# EAGLE board dw08b (EAGLE 6.6.0), part 1 of 5
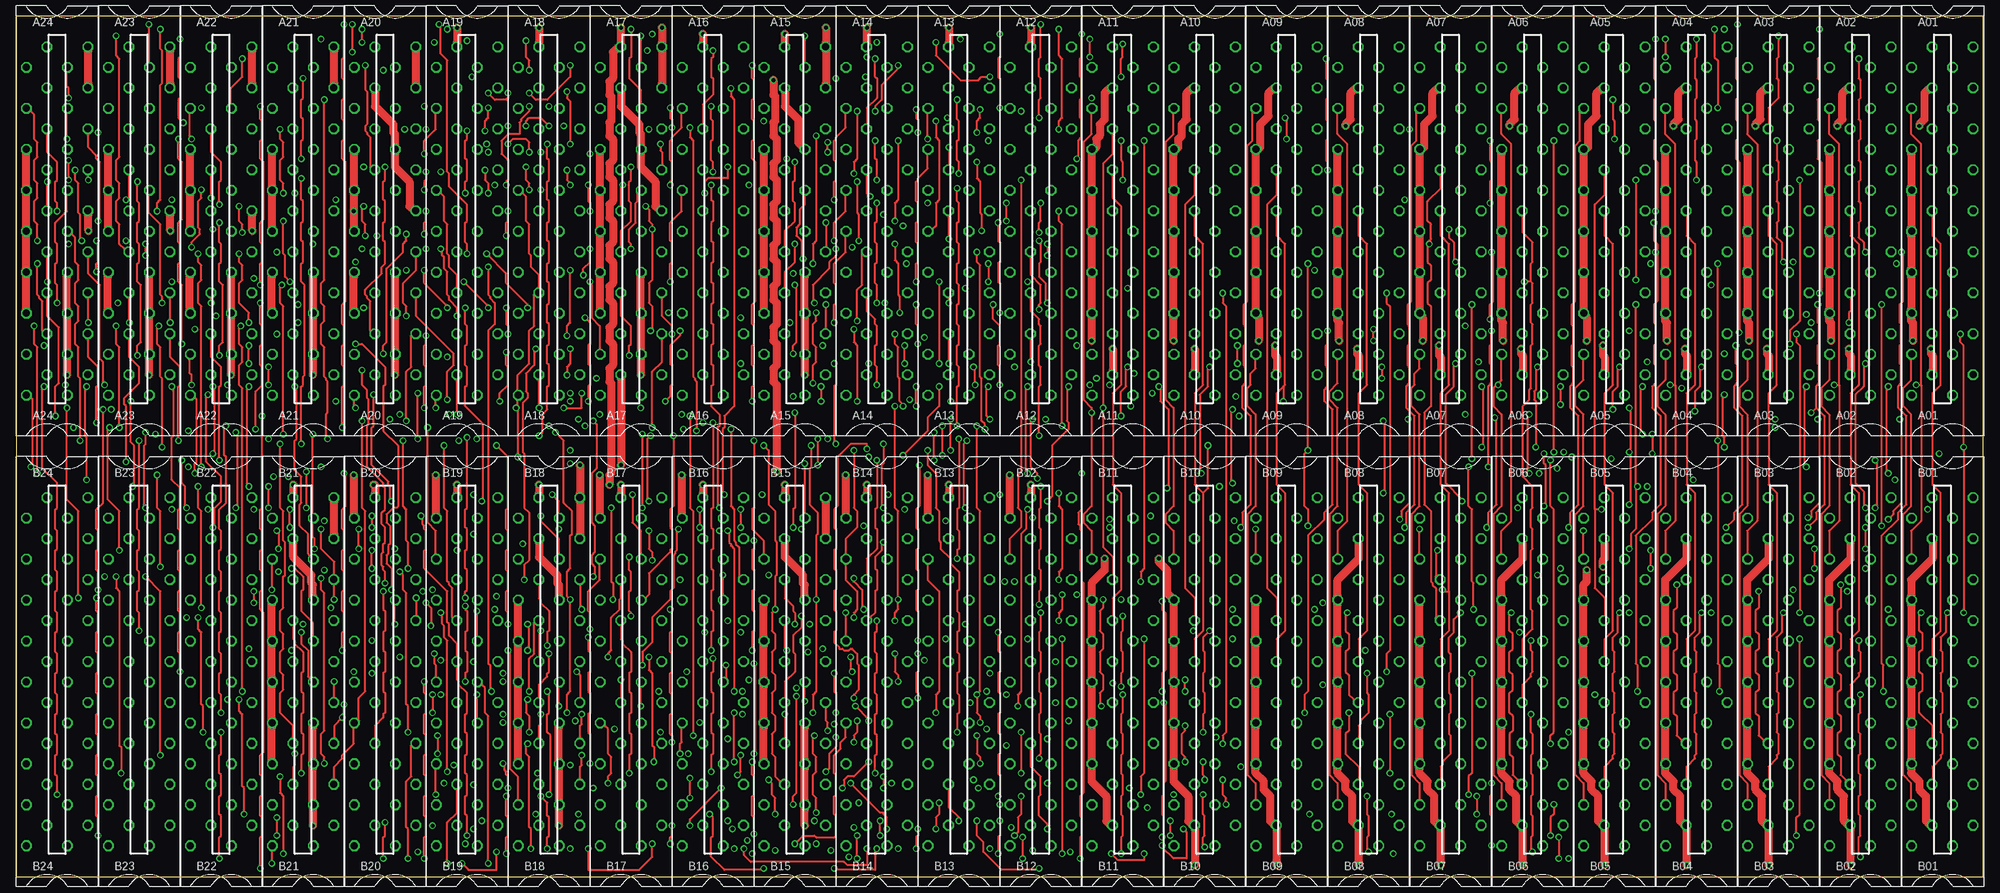
[diagram p7: board, top side]
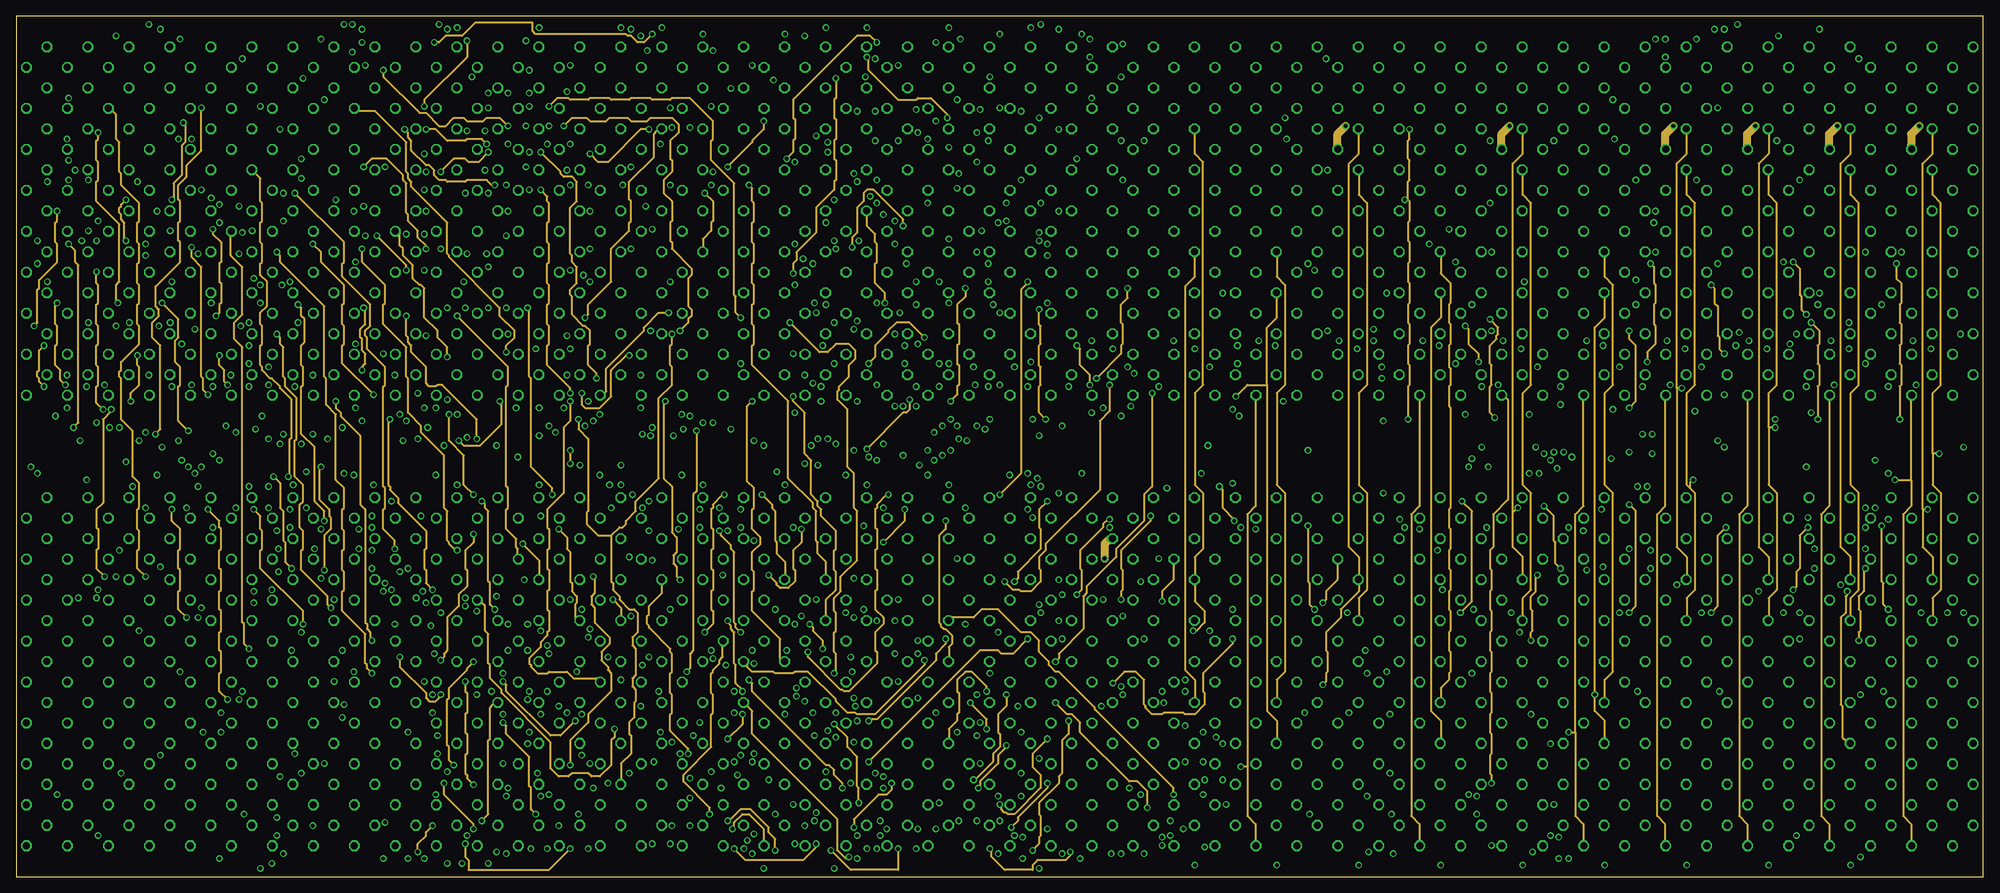
[diagram p8: board, inner layer 2]
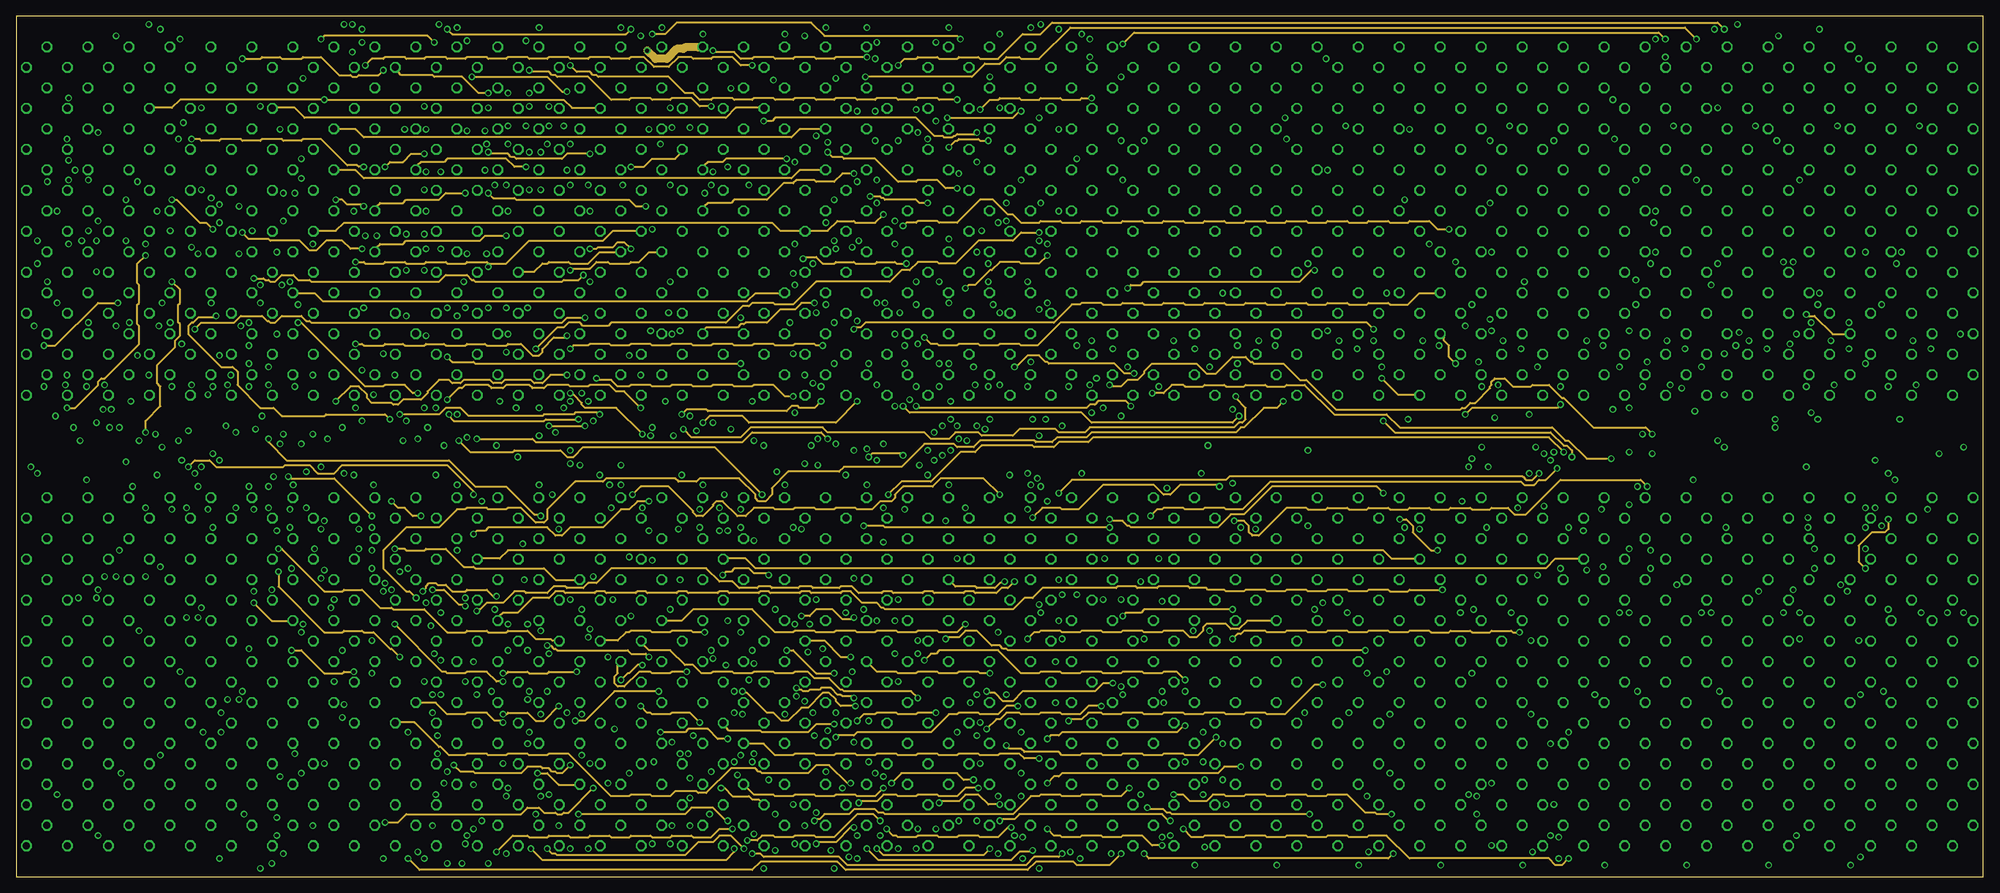
[diagram p9: board, inner layer 15]
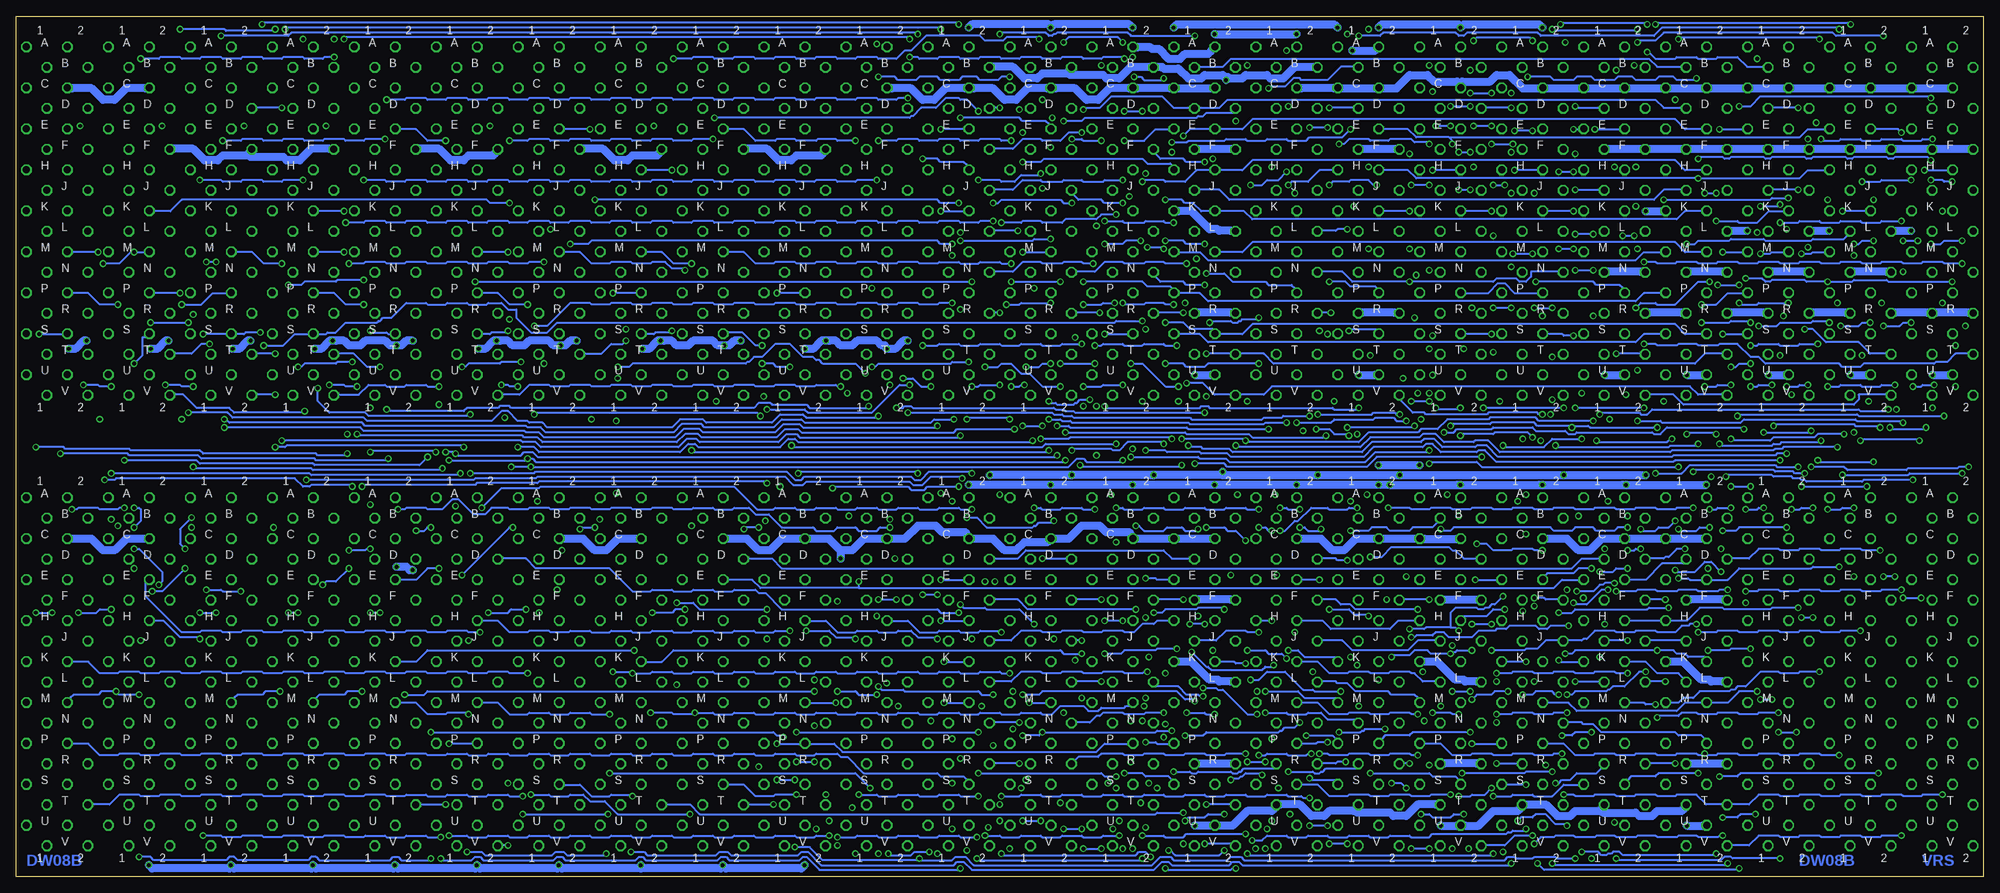
[diagram p10: board, bottom side, seen from below]

Size 304.8 x 133.35 mm. Coordinates in mm from the lower left corner, seen from the top.
Outline: 0,0 304.8,0 304.8,133.35 0,133.35 0,0
Copper layers (1*2*15*16): Top 0.035mm / dielectric 1.5mm / 2 0.035mm / dielectric 0.15mm / 15 0.035mm / dielectric 0.2mm / Bottom 0.035mm
Design rules "10mils": minimum track width 12mil, minimum drill 24mil, track to track 10mil, track to pad 10mil, pad to pad 10mil, via to via 10mil, smd to smd 10mil, copper to edge 25mil, drill to drill 10mil, minimum pad ring 10mil, minimum via ring 8mil, stop-mask expansion 0mil, vias tented up to drill 0mil, thermal gap 10mil
Net classes: 1 supply: width 1.27 mm

## Footprints (pad centres in the part's own frame; a part is rotated, then mirrored left to right if it is on the bottom)
H807 = drill 1.092 octagon: A1 4.763,28.575; A2 -1.587,28.575; B1 1.587,25.4; B2 -4.763,25.4; C1 4.763,22.225; C2 -1.587,22.225; D1 1.587,19.05; D2 -4.763,19.05; E1 4.763,15.875; E2 -1.587,15.875; F1 1.587,12.7; F2 -4.763,12.7; H1 4.763,9.525; H2 -1.587,9.525; J1 1.587,6.35; J2 -4.763,6.35; K1 4.763,3.175; K2 -1.587,3.175; L1 1.587,0; L2 -4.763,0; M1 4.763,-3.175; M2 -1.587,-3.175; N1 1.587,-6.35; N2 -4.763,-6.35; P1 4.763,-9.525; P2 -1.587,-9.525; R1 1.587,-12.7; R2 -4.763,-12.7; S1 4.763,-15.875; S2 -1.587,-15.875; T1 1.587,-19.05; T2 -4.763,-19.05; U1 4.763,-22.225; U2 -1.587,-22.225; V1 1.587,-25.4; V2 -4.763,-25.4

## Placement (x,y rotation side)
A01  W011  [H807]  298.45,100.01 0 top
A02  W011  [H807]  285.75,100.01 0 top
A03  W011  [H807]  273.05,100.01 0 top
A04  W011  [H807]  260.35,100.01 0 top
A05  W011  [H807]  247.65,100.01 0 top
A06  W011  [H807]  234.95,100.01 0 top
A07  W011  [H807]  222.25,100.01 0 top
A08  W011  [H807]  209.55,100.01 0 top
A09  W011  [H807]  196.85,100.01 0 top
A10  W011  [H807]  184.15,100.01 0 top
A11  W011  [H807]  171.45,100.01 0 top
A12  M508  [H807]  158.75,100.01 0 top
A13  M508  [H807]  146.05,100.01 0 top
A14  M508  [H807]  133.35,100.01 0 top
A15  M906  [H807]  120.65,100.01 0 top
A16  M508  [H807]  107.95,100.01 0 top
A17  M906  [H807]  95.25,100.01 0 top
A18  M660  [H807]  82.55,100.01 0 top
A19  M660  [H807]  69.85,100.01 0 top
A20  M903  [H807]  57.15,100.01 0 top
A21  M903  [H807]  44.45,100.01 0 top
A22  M903  [H807]  31.75,100.01 0 top
A23  M903  [H807]  19.05,100.01 0 top
A24  M903  [H807]  6.35,100.01 0 top
B01  W011  [H807]  298.45,30.16 0 top
B02  W011  [H807]  285.75,30.16 0 top
B03  W011  [H807]  273.05,30.16 0 top
B04  W011  [H807]  260.35,30.16 0 top
B05  W011  [H807]  247.65,30.16 0 top
B06  W011  [H807]  234.95,30.16 0 top
B07  W011  [H807]  222.25,30.16 0 top
B08  W011  [H807]  209.55,30.16 0 top
B09  W011  [H807]  196.85,30.16 0 top
B10  W011  [H807]  184.15,30.16 0 top
B11  W011  [H807]  171.45,30.16 0 top
B12  M508  [H807]  158.75,30.16 0 top
B13  M508  [H807]  146.05,30.16 0 top
B14  M508  [H807]  133.35,30.16 0 top
B15  M906  [H807]  120.65,30.16 0 top
B16  M051  [H807]  107.95,30.16 0 top
B17  M051  [H807]  95.25,30.16 0 top
B18  M906  [H807]  82.55,30.16 0 top
B19  M051  [H807]  69.85,30.16 0 top
B20  M051  [H807]  57.15,30.16 0 top
B21  M906  [H807]  44.45,30.16 0 top
B22  H807  [H807]  31.75,30.16 0 top
B23  H807  [H807]  19.05,30.16 0 top
B24  H807  [H807]  6.35,30.16 0 top

## Tracks (layer width: path | path; a pad name or v marks a point on that pad's centre or on a via)
!N_MB03  (via drill 0.61)
  Top 0.305: 271.53,70.87 271.53,60.71 272.8,59.44 272.8,38.1 271.53,36.83 271.53,34.04 B03.K2 | 271.53,70.87 271.53,74.93 272.8,76.2 272.8,98.04 271.53,99.31 271.53,102.62 A03.K2 | v158.5,87.88 158.5,88.65 158.75,88.9 158.75,91.69 157.23,93.22 157.23,96.27 A12.M2 | v272.54,70.87 271.53,70.87
  2 0.305: v158.5,87.88 158.5,85.6 158.75,85.34 158.75,82.55 158.5,82.3 158.5,79.25 158.75,78.99 158.75,76.2 158.5,75.95 158.5,71.88 v159.51,70.87
  Bottom 0.305: v159.51,70.87 162.56,70.87 163.07,70.36 182.63,70.36 183.13,70.87 186.18,70.87 187.45,69.6 198.12,69.6 198.63,70.1 201.68,70.1 202.95,68.83 222.76,68.83 223.52,69.6 225.55,69.6 225.81,69.85 250.7,69.85 251.21,70.36 271.78,70.36 272.29,70.87 v272.54,70.87
!N_MB04  (via drill 0.61)
  Top 0.305: v270,44.2 270,41.66 269.49,41.15 269.49,38.1 270,37.59 270,35.31 269.49,34.8 269.49,31.75 270,31.24 270,28.96 269.49,28.45 269.49,25.4 270,24.89 270,21.84 270.76,21.08 B03.P2 | v277.62,54.1 278.89,55.37 278.89,56.39 280.16,57.66 280.16,71.37 278.89,72.64 | 278.89,72.64 278.89,75.95 279.4,76.45 279.4,79.25 279.15,79.5 279.15,82.3 279.4,82.55 279.4,85.6 279.15,85.85 v279.15,88.65 | v157.23,79.76 157.23,83.57 A12.S2 | v172.21,78.99 171.96,78.74 171.96,75.95 171.2,75.18 v171.2,71.37 | v278.13,71.88 278.89,72.64
  2 0.305: v275.34,44.45 275.84,44.96 275.84,47.24 276.35,47.75 276.35,52.83 v277.62,54.1
  Bottom 0.305: v270,44.2 272.8,44.2 273.05,44.45 v275.34,44.45 | v279.15,88.65 276.1,88.65 274.32,90.42 272.03,90.42 A03.P2 | v157.23,79.76 159.77,79.76 160.02,79.5 171.2,79.5 171.7,78.99 v172.21,78.99 | v171.2,71.37 171.45,71.12 182.37,71.12 182.88,71.63 186.44,71.63 187.71,70.36 197.87,70.36 198.37,70.87 201.93,70.87 203.2,69.6 222.5,69.6 223.27,70.36 225.3,70.36 225.55,70.61 227.08,70.61 228.6,72.14 229.62,72.14 231.14,70.61 250.44,70.61 250.95,71.12 271.27,71.12 272.03,71.88 v278.13,71.88
!N_MB05  (via drill 0.61)
  Top 0.305: A03.T2 268.22,80.26 268.22,76.96 266.95,75.69 266.95,72.9 268.22,71.63 268.22,57.4 266.95,56.13 266.95,15.75 268.22,14.48 268.22,11.68 B03.T2 | v144.53,113.03 144.53,110.24 A13.H2 | v171.2,114.05 171.2,111 171.45,110.74 v171.45,107.95 | v250.95,107.95 v250.95,92.46
  2 0.305: v262.64,91.69 263.14,91.19 263.14,88.9 263.65,88.39 263.65,83.82 263.91,83.57 263.91,81.79 v264.67,81.03
  15 0.305: v144.53,113.03 145.54,114.05 145.8,114.05 146.05,114.3 149.1,114.3 149.35,114.05 v150.62,114.05
  Bottom 0.305: v150.62,114.05 152.15,114.05 152.4,114.3 155.45,114.3 155.7,114.05 158.5,114.05 158.75,114.3 161.8,114.3 162.05,114.05 164.85,114.05 165.1,114.3 168.15,114.3 168.4,114.05 v171.2,114.05 | v171.45,107.95 174.5,107.95 174.75,107.7 177.55,107.7 177.8,107.95 180.85,107.95 181.1,107.7 183.9,107.7 184.15,107.95 187.2,107.95 187.45,107.7 190.25,107.7 190.5,107.95 193.55,107.95 193.8,107.7 196.6,107.7 196.85,107.95 199.9,107.95 200.15,107.7 202.95,107.7 203.2,107.95 206.25,107.95 206.5,107.7 209.3,107.7 209.55,107.95 212.6,107.95 212.85,107.7 215.65,107.7 215.9,107.95 218.95,107.95 219.2,107.7 222,107.7 222.25,107.95 225.3,107.95 225.55,107.7 228.35,107.7 228.6,107.95 231.65,107.95 231.9,107.7 234.7,107.7 234.95,107.95 238,107.95 238.25,107.7 241.05,107.7 241.3,107.95 244.35,107.95 244.6,107.7 247.4,107.7 247.65,107.95 v250.95,107.95 | v250.95,92.46 255.02,92.46 255.27,92.2 260.1,92.2 260.6,91.69 v262.64,91.69 | v264.67,81.03 267.72,81.03 A03.T2
!N_MB06  (via drill 0.61)
  Top 0.305: 257.05,76.2 257.05,55.12 255.52,53.59 255.52,49.78 B04.D2 | 257.05,76.2 257.05,113.54 255.52,115.06 255.52,118.36 A04.D2 | v148.84,96.77 148.84,95.25 149.35,94.74 149.35,77.47 149.61,77.22 149.61,70.61 150.11,70.1 v150.11,69.34 | v251.97,68.58 251.71,68.83 251.71,75.69 v251.97,75.95 | v256.29,76.2 257.05,76.2
  Bottom 0.305: v148.84,96.77 145.03,96.77 A13.M2 | v150.11,69.34 159,69.34 159.51,68.83 183.13,68.83 183.64,69.34 185.67,69.34 186.94,68.07 198.63,68.07 199.14,68.58 201.17,68.58 202.44,67.31 223.27,67.31 224.03,68.07 226.06,68.07 226.31,68.33 251.71,68.33 v251.97,68.58 | v251.97,75.95 253.75,75.95 254,76.2 v256.29,76.2
!N_MB07  (via drill 0.61)
  Top 0.305: v144.53,79.5 144.53,83.57 A13.S2 | v148.34,78.99 148.59,78.74 v148.59,76.2 | v150.62,75.95 150.37,75.69 150.37,71.37 v150.88,70.87 | v157.48,70.87 157.23,70.61 157.23,63.5 158.24,62.48 v158.24,61.72
  2 0.305: 259.33,60.2 260.1,59.44 260.1,44.45 258.83,43.18 258.83,40.39 B04.H2 | 259.33,60.2 258.83,60.71 258.83,74.93 260.1,76.2 260.1,104.39 258.83,105.66 258.83,108.97 A04.H2 | v259.84,61.47 259.33,60.96 259.33,60.2
  Bottom 0.305: v144.53,79.5 145.8,79.5 146.3,78.99 v148.34,78.99 | v148.59,76.2 149.1,76.2 149.35,75.95 v150.62,75.95 | v150.88,70.87 151.13,71.12 157.23,71.12 v157.48,70.87 | v158.24,61.72 158.5,61.98 163.07,61.98 164.34,60.71 165.86,60.71 166.37,61.21 182.37,61.21 182.88,60.71 184.4,60.71 185.67,61.98 224.03,61.98 224.28,61.72 233.68,61.72 233.93,61.47 v259.84,61.47
!N_MB08  (via drill 0.61)
  Top 0.305: v251.21,28.7 251.21,32.77 250.95,33.02 250.95,52.83 253.49,55.37 253.49,56.39 254.76,57.66 254.76,71.37 253.49,72.64 253.49,75.95 254,76.45 254,79.25 253.75,79.5 253.75,82.3 254,82.55 254,85.6 253.75,85.85 253.75,88.65 254.25,89.15 254.25,96.52 v254,96.77 254.25,97.03 254.25,98.04 253.75,98.55 v253.75,101.35 | v132.33,105.41 131.83,105.92 131.83,108.97 A14.H2 | v153.42,101.6 v153.42,104.39
  15 0.305: v132.33,105.41 133.86,105.41 134.11,105.16 134.37,105.16 134.62,104.9 139.45,104.9 139.95,104.39 v141.22,104.39
  Bottom 0.305: v251.21,28.7 253.49,28.7 254,28.19 257.81,28.19 258.32,27.69 B04.M2 | v254,96.77 258.06,96.77 A04.M2 | v141.22,104.39 142.49,104.39 143,104.9 152.15,104.9 152.65,104.39 v153.42,104.39 | v153.42,101.6 155.45,101.6 155.7,101.35 158.5,101.35 158.75,101.6 161.8,101.6 162.05,101.35 164.85,101.35 165.1,101.6 168.15,101.6 168.4,101.35 171.2,101.35 171.45,101.6 174.5,101.6 174.75,101.35 177.55,101.35 177.8,101.6 180.85,101.6 181.1,101.35 183.9,101.35 184.15,101.6 187.2,101.6 187.45,101.35 190.25,101.35 190.5,101.6 193.55,101.6 193.8,101.35 196.6,101.35 196.85,101.6 199.9,101.6 200.15,101.35 202.95,101.35 203.2,101.6 206.25,101.6 206.5,101.35 209.3,101.35 209.55,101.6 212.6,101.6 212.85,101.35 215.65,101.35 215.9,101.6 218.95,101.6 219.2,101.35 222,101.35 222.25,101.6 225.3,101.6 225.55,101.35 228.35,101.35 228.6,101.6 231.65,101.6 231.9,101.35 234.7,101.35 234.95,101.6 238,101.6 238.25,101.35 241.05,101.35 241.3,101.6 244.35,101.6 244.6,101.35 247.4,101.35 247.65,101.6 250.7,101.6 250.95,101.35 v253.75,101.35
!P_MB03  (via drill 0.61)
  Top 0.305: v149.61,100.08 149.61,102.62 149.35,102.87 149.35,107.7 148.84,108.2 v148.84,110.74
  15 0.305: A15.H1 124.71,109.47 121.41,109.47 120.14,108.2 53.85,108.2 52.58,109.47 49.78,109.47 A21.H1
  Bottom 0.305: v149.61,100.08 153.42,100.08 A12.L2 | v148.84,110.74 146.05,110.74 145.54,111.25 130.3,111.25 129.54,110.49 125.98,110.49 125.73,110.24 A15.H1
!P_MB04  (via drill 0.61)
  Top 0.305: v152.4,87.38 152.4,91.95 152.15,92.2 152.15,95 152.4,95.25 152.4,98.3 152.15,98.55 v152.15,101.35
  15 0.305: A21.L1 46.74,100.08 49.53,100.08 50.8,101.35 117.09,101.35 118.36,100.08 121.67,100.08 A15.L1 122.94,100.08 125.73,100.08 127.25,101.6 129.79,101.6 130.05,101.35 133.1,101.35 v134.37,102.62
  Bottom 0.305: v152.4,87.38 153.42,87.38 A12.R2 | v152.15,101.35 149.1,101.35 148.84,101.6 146.05,101.6 145.8,101.35 142.75,101.35 142.24,101.85 137.41,101.85 136.65,102.62 v134.37,102.62
!P_MB05  (via drill 0.61)
  Top 0.305: v139.45,92.2 139.45,95 139.7,95.25 139.7,98.04 139.45,98.3 139.45,101.35 139.7,101.6 139.7,104.39 139.45,104.65 139.45,107.7 139.7,107.95 139.7,108.2 141.22,109.73 141.22,112.01 A13.F2
  Bottom 0.305: A21.P1 49.78,90.42 52.58,90.42 53.85,89.15 120.14,89.15 121.41,90.42 124.71,90.42 A15.P1 125.73,91.19 125.98,91.44 129.54,91.44 130.3,92.2 v139.45,92.2
!P_MB06  (via drill 0.61)
  Top 0.305: v142.49,117.09 142.49,114.55 143,114.05 143,104.9 142.49,104.39 142.49,100.84 141.99,100.33 A13.L2
  15 0.305: A15.D2 115.32,119.13 111.51,119.13 109.98,117.6 44.7,117.6 43.18,119.13 40.39,119.13 A21.D2
  Bottom 0.305: v142.49,117.09 139.7,117.09 139.19,117.6 121.92,117.6 121.67,117.86 120.9,117.86 120.4,118.36 116.33,118.36 A15.D2
!P_MB07  (via drill 0.61)
  Top 0.305: v136.91,87.38 136.91,89.92 136.65,90.17 136.65,95 136.14,95.5 v136.14,98.04 | v130.56,98.55 130.56,102.62 130.3,102.87 v130.3,107.7
  Bottom 0.305: A21.H2 43.43,109.47 46.23,109.47 47.75,111 113.28,111 114.81,109.47 118.36,109.47 A15.H2 119.63,109.47 121.92,109.47 123.7,107.7 126.75,107.7 127,107.95 130.05,107.95 v130.3,107.7 | v136.91,87.38 140.72,87.38 A13.R2 | v136.14,98.04 133.35,98.04 132.84,98.55 v130.56,98.55
!P_MB08  (via drill 0.61)
  Top 0.305: v120.65,110.74 120.65,107.95 120.4,107.7 120.4,104.65 120.65,104.39 120.65,101.6 119.13,100.08 119.13,97.54 A15.M2
  Bottom 0.305: A15.M2 118.36,96.77 114.81,96.77 113.28,98.3 47.75,98.3 46.23,96.77 43.43,96.77 A21.M2 | v120.65,110.74 123.44,110.74 123.95,111.25 127.51,111.25 128.27,112.01 A14.F2
-15V  (via drill 0.61)
  Top 1.27: v52.32,62.23 52.32,56.13 B20.B2 | v65.02,62.23 65.02,56.13 B19.B2 | v90.42,62.23 90.42,56.13 B17.B2 | v103.12,62.23 103.12,56.13 B16.B2 | v128.52,62.23 128.52,56.13 B14.B2 | v141.22,62.23 141.22,56.13 B13.B2 | v153.92,62.23 153.92,56.13 B12.B2 | v117.35,123.44 117.35,121.16 117.6,120.9 117.6,117.09 117.35,116.84 117.35,114.81 117.86,114.3 117.86,111 117.35,110.49 117.35,108.46 117.86,107.95 117.86,104.65 117.35,104.14 117.35,102.11 117.86,101.6 117.86,98.3 117.35,97.79 117.35,95.76 117.86,95.25 117.86,91.95 117.35,91.44 117.35,89.41 117.86,88.9 117.86,85.6 117.35,85.09 117.35,83.06 117.86,82.55 117.86,79.25 117.35,78.74 117.35,76.71 117.86,76.2 v117.86,62.74
  Bottom 1.27: 141.86,124.59 141.99,124.46 145.8,124.46 146.56,123.7 148.59,123.7 150.37,125.48 153.42,125.48 A12.B2 | 141.86,124.59 141.73,124.71 A13.B2 | 116.84,123.7 114.81,123.7 114.3,124.21 111,124.21 110.49,123.7 108.46,123.7 106.68,125.48 103.89,125.48 A16.B2 | 116.84,123.7 117.09,123.95 117.6,123.95 117.86,124.21 120.65,124.21 121.16,123.7 123.19,123.7 124.71,125.22 127,125.22 127.25,125.48 128.02,125.48 A14.B2 129.29,125.48 132.08,125.48 133.86,123.7 135.89,123.7 136.4,124.21 141.48,124.21 141.86,124.59 | v52.32,62.23 v65.02,62.23 65.53,62.23 v90.42,62.23 90.93,62.23 v103.12,62.23 103.63,62.23 117.86,62.23 | 117.86,62.23 v128.52,62.23 129.03,62.23 v141.22,62.23 141.73,62.23 v153.92,62.23 | 116.84,123.7 v117.35,123.44 | v117.86,62.74 117.86,62.23
GND  (via drill 0.61)
  Top 1.27: B15.A1 125.48,58.17 125.48,53.09 B15.C1 | v122.17,7.87 122.17,10.41 B15.T1 122.17,11.68 122.17,16.76 B15.R1 122.17,18.03 122.17,23.11 B15.N1 | B15.R2 115.82,18.03 115.82,23.11 B15.N2 115.82,24.38 115.82,29.46 B15.L2 115.82,30.73 115.82,35.81 B15.J2 115.82,37.08 115.82,42.16 B15.F2 | B15.C2 119.13,51.82 119.13,49.53 121.92,46.74 121.92,45.47 122.17,45.21 122.17,43.43 B15.F1 | B21.A1 49.28,58.17 49.28,53.09 B21.C1 | v45.97,7.87 45.97,10.41 B21.T1 45.97,11.68 45.97,16.76 B21.R1 45.97,18.03 45.97,23.11 B21.N1 | B21.R2 39.62,18.03 39.62,23.11 B21.N2 39.62,24.38 39.62,29.46 B21.L2 39.62,30.73 39.62,35.81 B21.J2 39.62,37.08 39.62,42.16 B21.F2 | B21.C2 42.93,51.82 42.93,49.53 45.72,46.74 45.72,45.47 45.97,45.21 45.97,43.43 B21.F1 | B18.C1 87.38,53.09 87.38,58.17 B18.A1 87.38,59.44 v87.38,63.75 | v84.07,7.87 84.07,10.41 B18.T1 84.07,11.68 84.07,16.76 B18.R1 84.07,18.03 84.07,23.11 B18.N1 | B18.R2 77.72,18.03 77.72,23.11 B18.N2 77.72,24.38 77.72,29.46 B18.L2 77.72,30.73 77.72,35.81 B18.J2 77.72,37.08 77.72,42.16 B18.F2 | B18.C2 81.03,51.82 81.03,49.53 83.82,46.74 83.82,45.47 84.07,45.21 84.07,43.43 B18.F1 | B08.C2 208.03,51.82 208.03,49.28 204.72,45.97 204.72,43.43 B08.F2 204.72,42.16 204.72,37.08 B08.J2 204.72,35.81 204.72,30.73 B08.L2 204.72,29.46 204.72,24.38 B08.N2 204.72,23.11 204.72,18.03 B08.R2 204.72,16.76 204.72,16 205.99,14.73 205.99,13.46 207.01,12.45 207.01,8.64 207.26,8.38 B08.U2 208.03,7.37 v208.03,1.78 | B01.U2 296.16,8.38 295.91,8.64 295.91,12.45 294.89,13.46 294.89,14.73 293.62,16 293.62,16.76 B01.R2 293.62,18.03 293.62,23.11 B01.N2 293.62,24.38 293.62,29.46 B01.L2 293.62,30.73 293.62,35.81 B01.J2 293.62,37.08 293.62,42.16 B01.F2 293.62,43.43 293.62,45.97 296.93,49.28 296.93,51.82 B01.C2
  Top 1.27: B02.C2 284.23,51.82 284.23,49.28 280.92,45.97 280.92,43.43 B02.F2 280.92,42.16 280.92,37.08 B02.J2 280.92,35.81 280.92,30.73 B02.L2 280.92,29.46 280.92,24.38 B02.N2 280.92,23.11 280.92,18.03 B02.R2 280.92,16.76 280.92,16 282.19,14.73 282.19,13.46 283.21,12.45 283.21,8.64 283.46,8.38 B02.U2 284.23,7.37 v284.23,1.78 | B03.C2 271.53,51.82 271.53,49.28 268.22,45.97 268.22,43.43 B03.F2 268.22,42.16 268.22,37.08 B03.J2 268.22,35.81 268.22,30.73 B03.L2 268.22,29.46 268.22,24.38 B03.N2 268.22,23.11 268.22,18.03 B03.R2 268.22,16.76 268.22,16 269.49,14.73 269.49,13.46 270.51,12.45 270.51,8.64 270.76,8.38 B03.U2 271.53,7.37 v271.53,1.78 | B04.C2 258.83,51.82 258.83,49.28 255.52,45.97 255.52,43.43 B04.F2 255.52,42.16 255.52,37.08 B04.J2 255.52,35.81 255.52,30.73 B04.L2 255.52,29.46 255.52,24.38 B04.N2 255.52,23.11 255.52,18.03 B04.R2 255.52,16.76 255.52,16 256.79,14.73 256.79,13.46 257.81,12.45 257.81,8.64 258.06,8.38 B04.U2 258.83,7.37 v258.83,1.78 | v245.87,48.01 245.87,49.02 246.13,49.28 246.13,51.82 B05.C2 | v243.33,47.5 243.33,45.72 242.82,45.21 242.82,43.43 B05.F2 242.82,42.16 242.82,37.08 B05.J2 242.82,35.81 242.82,30.73 B05.L2 242.82,29.46 242.82,24.38 B05.N2 242.82,23.11 242.82,18.03 B05.R2 242.82,16.76 242.82,16 244.09,14.73 244.09,13.46 245.11,12.45 245.11,8.64 245.36,8.38 B05.U2 246.13,7.37 v246.13,1.78 | B06.C2 233.43,51.82 233.43,49.28 230.12,45.97 230.12,43.43 B06.F2 230.12,42.16 230.12,37.08 B06.J2 230.12,35.81 230.12,30.73 B06.L2 230.12,29.46 230.12,24.38 B06.N2 230.12,23.11 230.12,18.03 B06.R2 230.12,16.76 230.12,16 231.39,14.73 231.39,13.46 232.41,12.45 232.41,8.64 232.66,8.38 B06.U2 233.43,7.37 v233.43,1.78
  Top 1.27: B07.F2 217.42,42.16 217.42,37.08 B07.J2 217.42,35.81 217.42,30.73 B07.L2 217.42,29.46 217.42,24.38 B07.N2 217.42,23.11 217.42,18.03 B07.R2 217.42,16.76 217.42,16 218.69,14.73 218.69,13.46 219.71,12.45 219.71,8.64 219.96,8.38 B07.U2 220.73,7.37 v220.73,1.78 | B09.F2 192.02,42.16 192.02,37.08 B09.J2 192.02,35.81 192.02,30.73 B09.L2 192.02,29.46 192.02,24.38 B09.N2 192.02,23.11 192.02,18.03 B09.R2 192.02,16.76 192.02,16 193.29,14.73 193.29,13.46 194.31,12.45 194.31,8.64 194.56,8.38 B09.U2 195.33,7.37 v195.33,1.78 | B11.U2 169.16,8.38 168.91,8.64 168.91,12.45 166.62,14.73 166.62,16.76 B11.R2 166.62,18.03 166.62,23.11 B11.N2 166.62,24.38 166.62,29.46 B11.L2 166.62,30.73 166.62,35.81 B11.J2 166.62,37.08 166.62,42.16 B11.F2 166.62,43.43 166.62,45.47 168.66,47.5 v168.66,49.28 | v177.04,49.28 177.04,48.77 178.31,47.5 178.31,43.94 178.82,43.43 B10.F2 179.32,42.16 179.32,37.08 B10.J2 179.32,35.81 179.32,30.73 B10.L2 179.32,29.46 179.32,24.38 B10.N2 179.32,23.11 179.32,18.03 B10.R2 179.32,16.76 179.32,14.73 181.61,12.45 181.61,8.64 181.86,8.38 B10.U2 182.63,7.37 v182.63,1.78 | v169.93,81.79 169.93,78.49 A11.U2 | v166.62,83.06 166.62,86.61 A11.R2 166.62,87.88 166.62,92.96 A11.N2 166.62,94.23 166.62,99.31 A11.L2 166.62,100.58 166.62,105.66 A11.J2 166.62,106.93 166.62,112.01 A11.F2 167.39,113.03 167.39,114.3 167.89,114.81 167.89,116.59 168.66,117.35 168.66,121.41 169.16,121.92 A11.C2 | v182.63,81.79 182.63,78.49 A10.U2 | v179.32,83.06 179.32,86.61 A10.R2 179.32,87.88 179.32,92.96 A10.N2 179.32,94.23 179.32,99.31 A10.L2 179.32,100.58 179.32,105.66 A10.J2 179.32,106.93 179.32,112.01 A10.F2 180.09,113.03 180.09,114.3 180.59,114.81 180.59,116.59 181.36,117.35 181.36,121.41 181.86,121.92 A10.C2
  Top 1.27: v195.07,82.3 195.07,80.77 195.33,80.52 195.33,78.49 A09.U2 | v192.53,83.06 192.53,86.61 A09.R2 192.02,87.88 192.02,92.96 A09.N2 192.02,94.23 192.02,99.31 A09.L2 192.02,100.58 192.02,105.66 A09.J2 192.02,106.93 192.02,112.01 A09.F2 192.79,113.03 192.79,116.59 194.06,117.86 194.06,121.41 194.56,121.92 A09.C2 | v207.77,81.79 207.77,81.03 208.03,80.77 208.03,78.49 A08.U2 | v204.98,83.06 204.98,85.85 204.72,86.11 204.72,86.61 A08.R2 204.72,87.88 204.72,92.96 A08.N2 204.72,94.23 204.72,99.31 A08.L2 204.72,100.58 204.72,105.66 A08.J2 204.72,106.93 204.72,112.01 A08.F2 | v205.99,116.33 205.99,116.59 206.76,117.35 206.76,121.41 207.26,121.92 A08.C2 | v296.67,81.79 296.67,81.03 296.93,80.77 296.93,78.49 A01.U2 | v293.88,83.06 293.88,85.85 293.62,86.11 293.62,86.61 A01.R2 293.62,87.88 293.62,92.96 A01.N2 293.62,94.23 293.62,99.31 A01.L2 293.62,100.58 293.62,105.66 A01.J2 293.62,106.93 293.62,112.01 A01.F2 | v294.89,116.33 294.89,116.59 295.66,117.35 295.66,121.41 296.16,121.92 A01.C2 | v271.27,81.79 271.27,81.03 271.53,80.77 271.53,78.49 A03.U2 | v268.48,83.06 268.48,85.85 268.22,86.11 268.22,86.61 A03.R2 268.22,87.88 268.22,92.96 A03.N2 268.22,94.23 268.22,99.31 A03.L2 268.22,100.58 268.22,105.66 A03.J2 268.22,106.93 268.22,112.01 A03.F2 | v269.49,116.33 269.49,116.59 270.26,117.35 270.26,121.41 270.76,121.92 A03.C2 | v283.97,81.79 283.97,81.03 284.23,80.77 284.23,78.49 A02.U2 | v281.18,83.06 281.18,85.85 280.92,86.11 280.92,86.61 A02.R2 280.92,87.88 280.92,92.96 A02.N2 280.92,94.23 280.92,99.31 A02.L2 280.92,100.58 280.92,105.66 A02.J2 280.92,106.93 280.92,112.01 A02.F2
  Top 1.27: v282.19,116.33 282.19,116.59 282.96,117.35 282.96,121.41 283.46,121.92 A02.C2 | v220.47,82.3 220.47,80.77 220.73,80.52 220.73,78.49 A07.U2 | v217.93,83.06 217.93,86.61 A07.R2 217.42,87.88 217.42,92.96 A07.N2 217.42,94.23 217.42,99.31 A07.L2 217.42,100.58 217.42,105.66 A07.J2 217.42,106.93 217.42,112.01 A07.F2 218.19,113.03 218.19,116.59 219.46,117.86 219.46,121.41 219.96,121.92 A07.C2 | v233.17,81.79 233.17,81.03 233.43,80.77 233.43,78.49 A06.U2 | v230.38,83.06 230.38,85.85 230.12,86.11 230.12,86.61 A06.R2 230.12,87.88 230.12,92.96 A06.N2 230.12,94.23 230.12,99.31 A06.L2 230.12,100.58 230.12,105.66 A06.J2 230.12,106.93 230.12,112.01 A06.F2 | v231.39,116.33 231.39,116.59 232.16,117.35 232.16,121.41 232.66,121.92 A06.C2 | v245.87,82.3 245.87,80.77 246.13,80.52 246.13,78.49 A05.U2 | v243.33,83.06 243.33,86.61 A05.R2 242.82,87.88 242.82,92.96 A05.N2 242.82,94.23 242.82,99.31 A05.L2 242.82,100.58 242.82,105.66 A05.J2 242.82,106.93 242.82,112.01 A05.F2 243.59,113.03 243.59,116.59 244.86,117.86 244.86,121.41 245.36,121.92 A05.C2 | v258.57,81.79 258.57,81.03 258.83,80.77 258.83,78.49 A04.U2 | v255.78,83.06 255.78,85.85 255.52,86.11 255.52,86.61 A04.R2 255.52,87.88 255.52,92.96 A04.N2 255.52,94.23 255.52,99.31 A04.L2 255.52,100.58 255.52,105.66 A04.J2 255.52,106.93 255.52,112.01 A04.F2 | v256.79,116.33 256.79,116.59 257.56,117.35 257.56,121.41 258.06,121.92 A04.C2 | v122.17,77.72 122.17,80.26 A15.T1 122.17,81.53 122.17,86.61 A15.R1 122.17,87.88 122.17,92.96 A15.N1 | A15.R2 115.82,87.88 115.82,92.96 A15.N2 115.82,94.23 115.82,99.31 A15.L2 115.82,100.58 115.82,105.66 A15.J2 115.82,106.93 115.82,112.01 A15.F2
  Top 1.27: A15.C1 125.48,122.94 125.48,128.02 A15.A1 125.48,129.29 v125.48,131.57 | A15.F1 121.67,113.28 121.16,113.79 121.16,117.35 119.13,119.38 119.13,121.67 A15.C2 | A17.C1 100.08,122.94 100.08,128.02 A17.A1 100.08,129.29 v100.08,131.57 | A17.K1 99.31,103.63 99.06,103.89 99.06,107.7 96.77,109.98 96.77,112.01 A17.F1 96.77,113.28 96.77,115.06 96.52,115.32 96.52,116.59 93.73,119.38 93.73,121.67 A17.C2 | v96.77,77.72 96.77,80.26 A17.T1 96.77,81.53 96.77,86.61 A17.R1 96.77,87.88 96.77,92.96 A17.N1 | A17.R2 90.42,87.88 90.42,92.96 A17.N2 90.42,94.23 90.42,99.31 A17.L2 90.42,100.58 90.42,105.66 A17.J2 90.42,106.93 90.42,112.01 A17.F2 | A24.A1 11.18,128.02 11.18,122.94 A24.C1 | A23.A1 23.88,128.02 23.88,122.94 A23.C1 | A22.A1 36.58,128.02 36.58,122.94 A22.C1 | A21.A1 49.28,128.02 49.28,122.94 A21.C1 | A20.A1 61.98,128.02 61.98,122.94 A20.C1 | v58.67,77.72 58.67,80.26 A20.T1 58.67,81.53 58.67,86.61 A20.R1 58.67,87.88 58.67,92.96 A20.N1 | v45.97,77.72 45.97,80.26 A21.T1 45.97,81.53 45.97,86.61 A21.R1 45.97,87.88 45.97,92.96 A21.N1 | A20.N2 52.32,92.96 52.32,87.88 A20.R2 | A20.K1 61.21,103.63 60.96,103.89 60.96,107.7 58.67,109.98 58.67,112.01 A20.F1 58.67,113.28 58.67,115.06 58.42,115.32 58.42,116.59 55.63,119.38 55.63,121.67 A20.C2 | A20.L2 52.32,100.58 52.32,102.62 v52.32,103.12 52.32,105.66 A20.J2 52.32,106.93 52.32,112.01 A20.F2 | v33.27,77.72 33.27,80.26 A22.T1 33.27,81.53 33.27,86.61 A22.R1 33.27,87.88 33.27,92.96 A22.N1 | A21.N2 39.62,92.96 39.62,87.88 A21.R2 | v20.57,77.72 20.57,80.26 A23.T1 20.57,81.53 20.57,86.61 A23.R1 20.57,87.88 20.57,92.96 A23.N1
  Top 1.27: A22.N2 26.92,92.96 26.92,87.88 A22.R2 | v36.58,100.08 36.58,102.62 A22.K1 | A21.L2 39.62,100.58 39.62,105.66 A21.J2 39.62,106.93 39.62,112.01 A21.F2 | v23.88,100.08 23.88,102.62 A23.K1 | A22.L2 26.92,100.58 26.92,105.66 A22.J2 26.92,106.93 26.92,112.01 A22.F2 | v11.18,100.08 11.18,102.62 A24.K1 | A23.L2 14.22,100.58 14.22,105.66 A23.J2 14.22,106.93 14.22,112.01 A23.F2 | v7.87,77.72 7.87,80.26 A24.T1 7.87,81.53 7.87,86.61 A24.R1 7.87,87.88 7.87,92.96 A24.N1 | A24.R2 1.52,87.88 1.52,92.96 A24.N2 1.52,94.23 1.52,99.31 A24.L2 1.52,100.58 1.52,105.66 A24.J2 1.52,106.93 1.52,112.01 A24.F2 | A23.N2 14.22,92.96 14.22,87.88 A23.R2 | v93.73,63.75 93.73,77.22 A17.U2
  2 1.27: v168.66,49.28 168.66,51.56 169.16,52.07 B11.C2 | v205.99,116.33 204.72,115.06 204.72,113.28 A08.F2 | v294.89,116.33 293.62,115.06 293.62,113.28 A01.F2 | v269.49,116.33 268.22,115.06 268.22,113.28 A03.F2 | v282.19,116.33 280.92,115.06 280.92,113.28 A02.F2 | v231.39,116.33 230.12,115.06 230.12,113.28 A06.F2 | v256.79,116.33 255.52,115.06 255.52,113.28 A04.F2
  Bottom 1.27: B15.C2 119.63,52.32 124.71,52.32 B15.C1 125.98,52.32 131.06,52.32 B14.C2 132.08,53.09 132.33,53.34 135.89,53.34 136.91,54.36 139.7,54.36 141.73,52.32 143.76,52.32 B13.C2 145.03,51.82 148.59,51.82 149.86,50.55 151.64,50.55 153.42,52.32 156.46,52.32 B12.C2 157.48,53.09 157.73,53.34 161.29,53.34 162.31,54.36 165.1,54.36 167.13,52.32 169.16,52.32 B11.C2 170.43,52.32 173.48,52.32 175.26,50.55 177.04,50.55 | 97.41,10.29 97.54,10.16 101.35,10.16 102.11,9.4 104.14,9.4 105.92,11.18 108.97,11.18 B16.T1 109.98,10.41 110.24,10.16 114.05,10.16 116.33,7.87 118.36,7.87 B15.U2 119.63,7.87 v122.17,7.87 | 97.41,10.29 97.28,10.41 B17.T1 | B15.R2 116.59,17.53 121.67,17.53 B15.R1 | B15.K1 124.71,33.27 122.68,33.27 119.89,30.48 118.62,30.48 118.36,30.23 116.59,30.23 B15.L2 | B15.F1 121.67,42.93 116.59,42.93 B15.F2 | B21.C2 43.43,52.32 48.51,52.32 B21.C1 49.78,52.32 54.86,52.32 B20.C2 56.13,52.32 59.18,52.32 60.96,50.55 62.74,50.55 64.52,52.32 67.56,52.32 B19.C2 | v45.97,7.87 43.43,7.87 B21.U2 | B21.R2 40.39,17.53 45.47,17.53 B21.R1 | B21.K1 48.51,33.27 46.48,33.27 43.69,30.48 42.42,30.48 42.16,30.23 40.39,30.23 B21.L2 | B21.F1 45.47,42.93 40.39,42.93 B21.F2 | B18.C2 81.53,52.32 86.61,52.32 B18.C1 87.88,52.32 92.96,52.32 B17.C2 94.23,52.32 97.28,52.32 99.06,50.55 100.84,50.55 102.62,52.32 105.66,52.32 B16.C2 | 59.31,10.29 59.44,10.16 63.25,10.16 64.01,9.4 66.04,9.4 67.82,11.18 70.87,11.18 B19.T1 71.88,10.41 72.14,10.16 75.95,10.16 78.23,7.87 80.26,7.87 B18.U2 81.53,7.87 v84.07,7.87 | 59.31,10.29 59.18,10.41 B20.T1 | B18.R2 78.49,17.53 83.57,17.53 B18.R1
  Bottom 1.27: B18.K1 86.61,33.27 84.58,33.27 81.79,30.48 80.52,30.48 80.26,30.23 78.49,30.23 B18.L2 | B18.F1 83.57,42.93 78.49,42.93 B18.F2 | B21.T1 46.48,10.41 46.74,10.16 50.55,10.16 51.31,9.4 53.34,9.4 53.85,9.91 58.93,9.91 59.31,10.29 | 97.41,10.29 97.03,9.91 91.95,9.91 91.44,9.4 89.41,9.4 87.63,11.18 84.84,11.18 B18.T1 | B07.C2 219.96,52.32 216.92,52.32 215.14,50.55 213.36,50.55 211.58,52.32 208.53,52.32 B08.C2 | v245.87,48.01 244.35,48.01 243.84,47.5 v243.33,47.5 | B09.C2 194.56,52.32 191.52,52.32 189.74,50.55 187.96,50.55 186.18,52.32 183.13,52.32 B10.C2 181.86,52.32 178.82,52.32 177.04,50.55 | v177.04,49.28 177.04,50.04 177.04,50.55 | 195.2,1.65 194.82,1.27 183.13,1.27 v182.63,1.78 | 195.2,1.65 v195.33,1.78 | 220.6,1.65 220.22,1.27 208.03,1.27 | 220.6,1.65 v220.73,1.78 | 208.03,1.27 195.58,1.27 195.2,1.65 | 233.3,1.65 232.92,1.27 220.98,1.27 220.6,1.65 | 233.3,1.65 v233.43,1.78 | 246,1.65 245.62,1.27 233.68,1.27 233.3,1.65 | 246,1.65 v246.13,1.78 | 258.7,1.65 258.32,1.27 246.38,1.27 246,1.65 | 258.7,1.65 v258.83,1.78 | 271.4,1.65 271.02,1.27 259.08,1.27 258.7,1.65 | 271.4,1.65 v271.53,1.78 | v284.23,1.78 283.72,1.27 271.78,1.27 271.4,1.65 | B01.C2 296.16,52.32 293.12,52.32 291.34,50.55 289.56,50.55 287.78,52.32 284.73,52.32 B02.C2 | 208.03,1.27 v208.03,1.78 | v166.62,83.06 167.39,83.06 168.66,81.79 v169.93,81.79 170.18,82.3 170.69,82.3 171.45,83.06 174.5,83.06 175.26,82.3 177.04,82.3 177.8,83.06 178.82,83.06 v179.32,83.06 180.09,83.06 181.36,81.79 v182.63,81.79 | v192.53,83.06 193.55,83.06 194.31,82.3 v195.07,82.3 195.58,82.3 196.09,82.3 196.85,83.06 199.9,83.06 200.66,82.3 202.44,82.3 203.2,83.06 204.47,83.06 v204.98,83.06 205.49,83.06 206.76,81.79 v207.77,81.79
  Bottom 1.27: A10.F2 179.83,112.01 180.09,111.76 183.9,111.76 184.66,111 186.69,111 188.47,112.78 191.52,112.78 A09.F2 | v296.67,81.79 295.66,81.79 294.39,83.06 v293.88,83.06 | v271.27,81.79 270.26,81.79 268.99,83.06 v268.48,83.06 | v283.97,81.79 282.96,81.79 281.69,83.06 v281.18,83.06 | 268.86,111.89 268.99,111.76 272.8,111.76 273.56,111 275.59,111 277.37,112.78 280.42,112.78 A02.F2 | 268.86,111.89 268.73,112.01 A03.F2 | A01.C2 296.16,122.17 293.12,122.17 291.34,120.4 289.56,120.4 287.78,122.17 284.73,122.17 A02.C2 | v217.93,83.06 218.95,83.06 219.71,82.3 v220.47,82.3 220.98,82.3 221.49,82.3 222.25,83.06 225.3,83.06 226.06,82.3 227.84,82.3 228.6,83.06 229.87,83.06 v230.38,83.06 230.89,83.06 232.16,81.79 v233.17,81.79 | v243.33,83.06 244.35,83.06 245.11,82.3 v245.87,82.3 246.38,82.3 246.89,82.3 247.65,83.06 250.7,83.06 251.46,82.3 253.24,82.3 254,83.06 255.27,83.06 v255.78,83.06 256.29,83.06 257.56,81.79 v258.57,81.79 | A06.F2 230.63,112.01 230.89,111.76 234.7,111.76 235.46,111 237.49,111 239.27,112.78 242.32,112.78 A05.F2 | 268.86,111.89 268.48,111.51 263.4,111.51 262.89,111 260.86,111 259.08,112.78 256.29,112.78 A04.F2 | A08.F2 205.23,112.01 205.49,111.76 209.3,111.76 210.06,111 212.09,111 213.87,112.78 216.92,112.78 A07.F2 | v122.17,77.72 119.63,77.72 A15.U2 | A15.R2 116.59,87.38 121.67,87.38 A15.R1 | A15.K1 124.71,103.12 122.68,103.12 119.89,100.33 118.62,100.33 118.36,100.08 116.59,100.08 A15.L2 | A15.F1 121.67,112.78 116.59,112.78 A15.F2 | A15.C2 119.63,122.17 124.71,122.17 A15.C1 125.98,122.17 131.06,122.17 A14.C2 132.33,122.17 135.38,122.17 137.16,120.4 138.94,120.4 140.72,122.17 143.76,122.17 A13.C2 145.03,122.17 148.08,122.17 149.86,120.4 151.64,120.4 153.42,122.17 156.46,122.17 A12.C2 157.73,122.17 160.78,122.17 162.56,120.4 164.34,120.4 166.12,122.17 169.16,122.17 A11.C2
  Bottom 1.27: 81.28,122.94 81.53,123.19 85.09,123.19 86.11,124.21 88.9,124.21 90.93,122.17 92.96,122.17 A17.C2 94.23,122.17 99.31,122.17 A17.C1 100.58,122.17 105.66,122.17 A16.C2 | 81.28,122.94 A18.C2 | v96.77,77.72 94.23,77.72 A17.U2 | A17.R2 91.19,87.38 96.27,87.38 A17.R1 | A17.F1 96.27,112.78 91.19,112.78 A17.F2 | A24.C2 5.33,122.17 10.41,122.17 A24.C1 11.68,122.17 16.76,122.17 A23.C2 18.03,122.17 23.11,122.17 A23.C1 24.38,122.17 29.46,122.17 A22.C2 30.73,122.17 35.81,122.17 A22.C1 37.08,122.17 42.16,122.17 A21.C2 43.43,122.17 48.51,122.17 A21.C1 49.78,122.17 54.86,122.17 A20.C2 56.13,122.17 61.21,122.17 A20.C1 62.48,122.17 67.56,122.17 A19.C2 68.83,122.17 71.37,122.17 73.41,124.21 75.44,124.21 76.45,123.19 80.77,123.19 81.28,122.94 | v58.67,77.72 56.13,77.72 A20.U2 | v45.97,77.72 43.43,77.72 A21.U2 | A20.R2 51.82,87.38 46.74,87.38 A21.R1 | A20.N1 58.17,93.73 53.09,93.73 A20.N2 | v52.32,103.12 49.78,103.12 A21.K1 | A20.F1 58.17,112.78 53.09,112.78 A20.F2 51.82,112.78 46.74,112.78 A21.F1 45.47,112.78 40.39,112.78 A21.F2 39.12,112.78 34.04,112.78 A22.F1 32.77,112.78 27.69,112.78 A22.F2 26.42,112.78 21.34,112.78 A23.F1 20.07,112.78 14.99,112.78 A23.F2 13.72,112.78 8.64,112.78 A24.F1 7.37,112.78 2.29,112.78 A24.F2 | v33.27,77.72 30.73,77.72 A22.U2 | A21.R2 39.12,87.38 34.04,87.38 A22.R1 | v20.57,77.72 18.03,77.72 A23.U2 | A22.R2 26.42,87.38 21.34,87.38 A23.R1 | v36.58,100.08 39.12,100.08 A21.L2 | v23.88,100.08 26.42,100.08 A22.L2 | v11.18,100.08 13.72,100.08 A23.L2 | v7.87,77.72 5.33,77.72 A24.U2 | A24.R2 2.29,87.38 7.37,87.38 A24.R1 8.64,87.38 13.72,87.38 A23.R2
  Bottom 1.27: A23.N1 20.07,93.73 14.99,93.73 A23.N2 | A22.N1 32.77,93.73 27.69,93.73 A22.N2 | A21.N1 45.47,93.73 40.39,93.73 A21.N2 | v125.48,131.57 124.97,132.08 100.58,132.08 v100.08,131.57 | v93.73,63.75 v87.38,63.75
N$1  (via drill 0.61)
  Top 0.305: v85.34,109.47 85.34,107.95 85.85,107.44 v85.85,107.19 | v88.65,107.19 88.65,104.65 88.9,104.39 v88.9,103.12 | v101.35,107.19 101.35,107.7 101.6,107.95 101.6,110.74 101.35,111 101.35,114.05 101.6,114.3 101.6,114.55 103.12,116.08 103.12,118.36 A16.D2 | v93.98,107.19 93.73,106.93 93.73,103.89 A17.K2
  Bottom 0.305: v85.34,109.47 81.53,109.47 A18.H2 | v85.85,107.19 v88.65,107.19 | v88.9,103.12 92.96,103.12 A17.K2 | v101.35,107.19 100.84,107.7 98.3,107.7 98.04,107.95 95.25,107.95 94.49,107.19 v93.98,107.19
N$2  (via drill 0.61)
  Top 0.305: v95.25,109.98 95.25,107.95 95,107.7 95,104.65 95.25,104.39 95.25,101.6 93.73,100.08 93.73,97.54 A17.M2
  15 0.305: A18.N2 78.49,93.73 80.26,93.73 81.53,95 82.3,95 82.55,95.25 85.6,95.25 85.85,95 88.65,95 90.42,96.77 92.96,96.77 A17.M2 | v95.25,109.98 97.28,109.98 98.55,111.25 102.11,111.25 102.87,112.01 A16.F2
N$3  (via drill 0.61)
  Top 0.305: v101.35,92.2 101.35,95 101.6,95.25 101.6,98.3 101.35,98.55 101.35,101.35 103.12,103.12 103.12,105.66 A16.J2 | v81.03,72.64 81.03,77.22 A18.U2 | v84.84,72.64 87.63,72.64 v87.63,74.93 | v95,80.77 95,82.3 95.25,82.55 95.25,85.34 93.73,86.87 93.73,89.92 A17.P2
  2 0.305: v87.63,74.93 87.63,73.15 88.14,72.64 90.42,72.64 92.2,74.42 92.2,78.49 94.49,80.77 v95,80.77
  Bottom 0.305: v101.35,92.2 98.81,92.2 98.04,91.44 94.23,91.44 93.98,91.19 A17.P2 | v81.03,72.64 81.28,72.39 84.58,72.39 v84.84,72.64
N$4  (via drill 0.61)
  Top 0.305: v72.64,109.47 72.64,107.95 73.15,107.44 v73.15,105.92 | v97.54,103.89 98.04,103.38 98.04,101.6 98.55,101.09 v98.55,100.33 98.55,100.08 98.55,92.46 98.04,91.95 98.04,88.9 98.55,88.39 98.55,84.84 v98.3,84.58
  15 0.305: v73.15,105.92 73.91,105.16 77.22,105.16 77.47,104.9 95,104.9 96.01,103.89 v97.54,103.89
  Bottom 0.305: v72.64,109.47 68.83,109.47 A19.H2 | v98.55,100.33 100.08,100.33 100.33,100.08 102.62,100.08 A16.L2 | v98.3,84.58 98.04,84.84 93.98,84.84 A17.S2
N$5  (via drill 0.61)
  Top 0.305: v88.9,92.2 89.15,91.95 89.15,86.61 90.42,85.34 90.42,81.53 A17.T2
  Bottom 0.305: A16.N2 102.62,93.73 99.31,93.73 97.79,92.2 v88.9,92.2 75.95,92.2 75.44,92.71 72.39,92.71 71.88,92.2 70.87,92.2 70.1,92.96 70.1,93.73 65.79,93.73 A19.N2
N$6  (via drill 0.61)
  Top 0.305: v68.33,71.63 68.33,77.22 A19.U2
  2 0.305: v101.09,87.38 99.57,87.38 97.28,85.09 97.28,84.58 91.44,78.74 91.44,75.18 91.19,74.93 A17.V2
  Bottom 0.305: v101.09,87.38 102.62,87.38 A16.R2 | v68.33,71.63 68.83,71.63 69.09,71.88 76.71,71.88 76.96,71.63 86.36,71.63 86.61,71.88 88.39,71.88 90.42,73.91 A17.V2
N$7  (via drill 0.61)
  Top 0.305: A19.J2 65.79,105.92 66.29,105.41 66.29,101.6 66.8,101.09 66.8,96.52 67.06,96.27 67.06,94.49 68.33,93.22 68.33,91.19 A19.P2 | A18.J2 78.49,105.92 78.99,105.41 78.99,101.6 79.5,101.09 79.5,96.52 79.76,96.27 79.76,94.49 81.03,93.22 81.03,91.19 A18.P2 80.26,90.17 80.26,85.34 79.5,84.58 79.5,79.5 77.72,77.72 77.72,75.18 A18.V2 77.72,73.91 77.72,72.64 v77.47,72.64 77.72,72.39 v77.72,65.02 | v65.02,72.64 65.02,73.91 A19.V2 | v122.17,64.01 122.17,56.13 B15.B1
  Bottom 0.305: A18.P2 80.26,90.42 76.71,90.42 75.18,91.95 74.17,91.95 72.64,90.42 68.83,90.42 A19.P2 | v65.02,72.64 v77.47,72.64 | v122.17,64.01 117.6,64.01 117.09,63.5 95.5,63.5 93.98,65.02 v77.72,65.02
N_3CYCLE  (via drill 0.61)
  Top 0.305: 183.9,59.44 182.63,60.71 182.63,74.93 183.9,76.2 183.9,98.04 182.63,99.31 182.63,102.62 A10.K2 | 183.9,59.44 183.9,38.1 182.63,36.83 182.63,34.04 B10.K2 | v111.25,28.7 111.25,50.8 110.74,51.31 110.74,51.56 110.49,51.82 110.49,53.34 v110.24,53.59 | v112.27,56.9 v112.27,54.1 | v134.37,57.15 134.11,57.4 134.11,63.75 134.37,64.01 v134.37,67.06 | v184.66,66.8 184.66,60.2 183.9,59.44
  Bottom 0.305: v111.25,28.7 106.17,28.7 105.16,27.69 100.33,27.69 B17.M1 | v110.24,53.59 110.74,53.59 111.25,54.1 v112.27,54.1 | v112.27,56.9 114.05,56.9 114.3,57.15 117.35,57.15 117.6,56.9 120.4,56.9 120.65,57.15 123.7,57.15 123.95,56.9 126.75,56.9 127,57.15 130.05,57.15 130.3,56.9 133.1,56.9 133.35,57.15 v134.37,57.15 | v134.37,67.06 145.29,67.06 145.8,66.55 184.4,66.55 v184.66,66.8
N_AC00  (via drill 0.61)
  Top 0.305: v240.54,54.1 240.79,54.36 240.79,56.39 242.06,57.66 242.06,71.37 240.79,72.64 240.79,75.95 241.3,76.45 241.3,78.99 241.05,79.25 241.05,82.3 241.3,82.55 241.3,85.34 241.05,85.6 241.05,88.65 241.55,89.15 241.55,113.28 242.32,114.05 242.32,118.62 A05.D2 | v242.82,53.59 242.82,49.78 B05.D2
  15 0.305: B05.D2 242.32,49.28 238.51,49.28 236.98,47.75 114.55,47.75 113.03,49.28 110.24,49.28 B16.D1
  Bottom 0.305: v240.54,54.1 241.05,54.1 241.55,53.59 v242.82,53.59
N_AC01  (via drill 0.61)
  Top 0.305: v110.74,69.34 110.74,57.4 111.25,56.9 111.25,52.07 111.51,51.82 111.51,51.56 112.01,51.05 112.01,46.48 B16.E1 | v143.51,65.28 v143.51,69.85 | v236.73,65.53 236.73,64.01 236.98,63.75 236.98,57.66 v236.73,57.4 | v238.25,65.79 v238.25,114.05
  2 0.305: v236.73,57.4 238.25,55.88 238.25,52.07 238.51,51.82 238.51,48.51 v239.27,47.75
  Bottom 0.305: v110.74,69.34 123.19,69.34 123.44,69.6 141.48,69.6 141.73,69.85 v143.51,69.85 | v143.51,65.28 143.76,65.02 224.03,65.02 224.79,65.79 226.06,65.79 226.57,65.28 236.47,65.28 v236.73,65.53 236.98,65.79 v238.25,65.79 | v239.27,47.75 241.05,47.75 242.82,45.97 245.36,45.97 B05.E2 | v238.25,114.05 241.05,114.05 242.82,115.82 245.36,115.82 A05.E2
N_AC02  (via drill 0.61)
  Top 0.305: 244.6,56.9 244.6,44.7 246.13,43.18 246.13,40.39 B05.H2 | 244.6,56.9 244.6,104.14 246.13,105.66 246.13,108.97 A05.H2 | v109.47,46.74 109.47,43.43 B16.F1 | v245.62,56.9 244.6,56.9
  2 0.305: v116.59,46.74 117.86,45.47 117.86,45.21 118.36,44.7 119.63,44.7 120.65,45.72 120.65,47.5 120.4,47.75 120.4,50.55 121.67,51.82 v121.67,53.85
  15 0.305: v109.47,46.74 109.98,47.24 110.74,47.24 111.25,47.75 113.54,47.75 114.3,46.99 116.33,46.99 v116.59,46.74 | v131.32,54.36 134.37,54.36 134.62,54.1 v169.42,54.1
  Bottom 0.305: v121.67,53.85 121.92,53.59 123.7,53.59 124.21,54.1 126.49,54.1 127,53.59 130.05,53.59 130.81,54.36 v131.32,54.36 | v169.42,54.1 170.94,54.1 171.45,53.59 174.24,53.59 174.75,54.1 177.55,54.1 178.05,53.59 180.85,53.59 181.36,54.1 186.18,54.1 188.21,56.13 190.25,56.13 191.26,57.15 193.55,57.15 193.8,56.9 196.6,56.9 196.85,57.15 199.9,57.15 200.15,56.9 202.95,56.9 203.2,57.15 206.25,57.15 206.5,56.9 209.3,56.9 209.55,57.15 212.6,57.15 212.85,56.9 215.65,56.9 215.9,57.15 218.95,57.15 219.2,56.9 222,56.9 222.25,57.15 225.3,57.15 225.55,56.9 228.35,56.9 228.6,57.15 231.14,57.15 232.16,56.13 233.93,56.13 236.22,58.42 237.24,58.42 238.76,56.9 241.05,56.9 241.3,57.15 244.35,57.15 244.6,56.9 v245.62,56.9
N_AC03  (via drill 0.61)
  Top 0.305: A05.K2 246.13,102.62 246.13,99.31 247.4,98.04 247.4,76.2 246.13,74.93 246.13,60.71 247.4,59.44 247.4,38.1 246.13,36.83 246.13,34.04 B05.K2 | v130.05,26.42 132.08,24.38 v132.08,24.13
  2 0.305: v110.24,39.62 110.49,39.37 110.49,39.12 110.74,38.86 110.74,38.35 111.25,37.85 111.25,33.02 111.51,32.77 111.51,29.97 112.52,28.96 v112.52,28.7 | v132.08,24.13 132.33,24.38 133.35,24.38 142.49,33.53 142.49,34.54 144.02,36.07 v144.02,36.83
  15 0.305: v112.52,28.7 112.78,28.45 113.28,28.45 116.33,25.4 117.35,25.4 118.62,24.13 119.63,24.13 121.67,26.16 122.68,26.16 124.97,28.45 125.98,28.45 127,27.43 127,27.18 127.76,26.42 v130.05,26.42 | v144.02,36.83 144.27,37.08 146.05,37.08 147.07,38.1 148.84,38.1 151.13,35.81 152.4,35.81 152.91,35.31 153.42,35.31 153.67,35.05 v209.04,35.05
  Bottom 0.305: v110.24,39.62 112.01,39.62 B16.H1 | v209.04,35.05 241.05,35.05 242.82,33.27 245.36,33.27 B05.K2
N_AC04  (via drill 0.61)
  Top 0.305: v107.44,9.65 107.95,9.14 107.95,6.35 107.7,6.1 107.7,3.05 109.73,1.02 115.57,1.02 v115.82,1.27 | v126.75,1.27 127,1.02 133.1,1.02 133.1,4.06 v133.35,4.32 | v169.67,3.56 170.69,2.54 174.75,2.54 v174.75,3.56 | v234.95,3.81 234.7,4.06 234.7,6.1 234.95,6.35 234.95,9.4 234.7,9.65 234.7,12.45 234.95,12.7 234.95,15.75 234.7,16 234.7,18.8 234.95,19.05 234.95,22.1 234.7,22.35 v234.7,25.15
  2 0.305: A05.M2 246.13,96.27 246.13,92.96 247.4,91.69 247.4,76.2 246.13,74.93 246.13,60.71 247.4,59.44 247.4,31.75 246.13,30.48 246.13,27.69 B05.M2 | v107.44,9.65 107.44,10.67 103.38,14.73 103.38,15.75 107.7,20.07 107.7,25.15 107.95,25.4 107.95,28.19 107.7,28.45 107.7,31.5 107.95,31.75 107.95,32 108.97,33.02 108.97,33.53 109.47,34.04 109.47,35.81 B16.J1 | v150.88,4.32 151.13,4.06 151.13,3.05 153.16,1.02 157.48,1.02 157.48,1.78 158.24,2.54 162.56,2.54 163.32,3.3 v163.32,3.81
  15 0.305: v133.35,4.32 134.37,3.3 149.86,3.3 v150.88,4.32 | v174.75,3.56 175.51,2.79 212.6,2.79 v213.36,3.56
  Bottom 0.305: v115.82,1.27 116.33,1.27 116.59,1.02 126.49,1.02 v126.75,1.27 | v163.32,3.81 165.61,3.81 166.12,3.3 169.42,3.3 v169.67,3.56 | v213.36,3.56 213.61,3.3 219.46,3.3 219.96,3.81 221.23,3.81 221.74,3.3 232.16,3.3 232.66,3.81 v234.95,3.81 | v234.7,25.15 234.95,25.4 238,25.4 238.25,25.15 241.05,25.15 242.82,26.92 245.36,26.92 B05.M2
N_AC05  (via drill 0.61)
  Top 0.305: v181.1,28.7 v181.1,30.48
  2 0.305: A05.P2 246.13,89.92 246.13,86.61 244.6,85.09 v244.6,28.19 244.6,25.65 246.13,24.13 246.13,21.34 B05.P2 | v140.72,33.53 140.72,32.77 133.1,25.15 130.3,25.15 130.05,25.4 128.78,25.4 127,27.18 127,27.43 122.68,31.75 120.65,31.75 120.4,31.5 117.6,31.5 117.35,31.75 114.05,31.75 113.28,32.51 113.28,32.77 B16.K1
  15 0.305: v140.72,33.53 141.73,34.54 142.49,34.54 143,35.05 152.15,35.05 155.7,31.5 158.5,31.5 158.75,31.75 161.8,31.75 162.05,31.5 164.85,31.5 165.1,31.75 168.15,31.75 168.4,31.5 171.2,31.5 171.45,31.75 174.5,31.75 174.75,31.5 177.55,31.5 177.8,31.75 179.83,31.75 v181.1,30.48
  Bottom 0.305: v181.1,28.7 241.05,28.7 241.55,28.19 v244.6,28.19
N_AC06  (via drill 0.61)
  Top 0.305: v248.41,40.89 248.16,40.64 248.16,37.85 247.4,37.08 247.4,35.05 247.65,34.8 247.65,31.75 247.4,31.5 247.4,28.7 247.65,28.45 247.65,25.4 247.4,25.15 247.4,22.35 247.65,22.1 247.65,19.05 247.4,18.8 247.4,18.29 246.13,17.02 246.13,14.99 B05.S2 | v249.94,57.66 250.19,57.91 250.19,65.79 | 250.19,65.79 250.19,72.39 v249.94,72.64 | v109.98,32.77 109.98,30.73 B16.L1 | 250.19,65.79 v249.94,65.79
  2 0.305: v249.94,40.89 250.95,41.91 250.95,56.64 v249.94,57.66 | v249.94,72.64 250.95,73.66 250.95,82.3 249.94,83.31 v249.94,84.58 | v122.68,34.8 122.68,34.04 127.76,28.96 128.02,28.96 128.27,28.7 129.03,28.7 133.35,33.02 133.35,34.8 133.1,35.05 133.1,37.85 134.37,39.12 134.37,40.13 133.1,41.4 133.1,44.2 133.35,44.45 133.35,47.5 133.1,47.75 133.1,50.55 133.35,50.8 133.35,53.85 133.1,54.1 133.1,56.9 133.35,57.15 133.35,57.66 134.87,59.18 v135.13,59.18
  15 0.305: v135.13,59.18 137.16,61.21 141.73,61.21 146.3,65.79 148.59,65.79 149.61,66.8 157.48,66.8 157.73,66.55 160.78,66.55 161.54,67.31 166.12,67.31 166.88,68.07 237.49,68.07 v239.78,65.79
  Bottom 0.305: v248.41,40.89 v249.94,40.89 | v249.94,84.58 249.68,84.33 247.4,84.33 247.14,84.07 246.63,84.07 A05.S2 | v109.98,32.77 110.24,32.51 111.25,32.51 111.76,32 119.63,32 120.14,32.51 120.4,32.51 v122.68,34.8 | v239.78,65.79 240.03,66.04 249.68,66.04 v249.94,65.79
N_AC07  (via drill 0.61)
  Top 0.305: A05.T2 242.82,80.26 242.82,76.96 241.55,75.69 241.55,72.9 242.82,71.63 242.82,57.4 241.55,56.13 241.55,15.75 242.82,14.48 242.82,11.68 B05.T2 | v152.15,3.56 152.15,6.1 152.4,6.35 v152.4,8.64 | v178.82,6.35 v178.82,8.64 | v237.74,6.35 237.74,9.14 238.25,9.65 v238.25,11.18
  2 0.305: v129.03,3.05 128.78,2.79 128.52,2.79 127.25,4.06 127.25,8.89 114.05,22.1 114.05,25.65 113.28,26.42 B16.M1
  15 0.305: v152.4,8.64 152.65,8.89 154.69,8.89 155.45,9.65 177.55,9.65 178.56,8.64 v178.82,8.64
  Bottom 0.305: v129.03,3.05 129.79,3.81 130.81,3.81 131.32,3.3 151.89,3.3 v152.15,3.56 | v178.82,6.35 180.85,6.35 181.1,6.1 183.9,6.1 184.15,6.35 187.2,6.35 187.45,6.1 190.25,6.1 190.5,6.35 193.55,6.35 193.8,6.1 196.6,6.1 196.85,6.35 199.9,6.35 200.15,6.1 202.95,6.1 203.2,6.35 206.25,6.35 206.5,6.1 209.3,6.1 209.55,6.35 212.6,6.35 212.85,6.1 215.65,6.1 215.9,6.35 218.95,6.35 219.2,6.1 222,6.1 222.25,6.35 225.3,6.35 225.55,6.1 228.35,6.1 228.6,6.35 231.65,6.35 231.9,6.1 234.7,6.1 234.95,6.35 v237.74,6.35 | v238.25,11.18 242.32,11.18 B05.T2
N_AC08  (via drill 0.61)
  2 0.305: 241.55,22.35 241.55,9.4 242.82,8.13 242.82,5.33 B05.V2 | 241.55,22.35 241.55,56.13 242.82,57.4 242.82,73.91 A05.V2 | v126.75,23.62 128.78,21.59 128.78,20.07 130.3,18.54 130.3,13.97 130.56,13.72 v130.56,11.43 | v149.1,13.72 149.35,13.97 149.35,14.73 152.15,17.53 152.15,18.8 153.42,20.07 v153.42,20.32 | v240.54,22.35 241.55,22.35
  15 0.305: v126.75,23.62 123.95,23.62 122.68,22.35 115.57,22.35 115.32,22.61 110.49,22.61 109.98,23.11 B16.N1 | v130.56,11.43 130.81,11.68 133.35,11.68 134.37,12.7 136.4,12.7 136.65,12.45 139.45,12.45 139.7,12.7 142.75,12.7 143,12.45 145.8,12.45 147.07,13.72 v149.1,13.72 | v153.42,20.32 153.92,19.81 155.7,19.81 156.21,19.3 161.54,19.3 162.05,18.8 164.85,18.8 165.1,19.05 168.15,19.05 168.4,18.8 171.2,18.8 171.45,19.05 174.5,19.05 174.75,18.8 177.55,18.8 177.8,19.05 180.85,19.05 181.1,18.8 183.13,18.8 v185.93,21.59
  Bottom 0.305: v185.93,21.59 186.18,21.84 186.94,21.84 187.45,22.35 v240.54,22.35
N_AC09  (via drill 0.61)
  Top 0.305: A06.D2 230.12,118.36 230.12,115.06 231.65,113.54 231.65,55.12 230.12,53.59 230.12,49.78 B06.D2 | v158.5,18.29 158.5,18.8 158.75,19.05 158.75,22.1 158.5,22.35 158.5,25.15 158.75,25.4 158.75,28.45 158.5,28.7 158.5,31.5 158.75,31.75 158.75,34.8 158.5,35.05 158.5,37.85 158.75,38.1 v158.75,40.89
  15 0.305: v158.5,18.29 156.21,18.29 155.45,19.05 152.4,19.05 152.15,18.8 149.35,18.8 149.1,19.05 146.05,19.05 145.8,18.8 143,18.8 142.75,19.05 139.7,19.05 139.45,18.8 136.65,18.8 136.4,19.05 133.35,19.05 133.1,18.8 130.3,18.8 130.05,19.05 127,19.05 126.75,18.8 123.95,18.8 123.7,19.05 120.65,19.05 120.4,18.8 117.6,18.8 115.82,20.57 113.28,20.57 B16.P1
  Bottom 0.305: v158.75,40.89 161.54,40.89 162.05,41.4 186.18,41.4 188.72,43.94 189.74,43.94 190.25,44.45 193.55,44.45 193.8,44.2 196.6,44.2 196.85,44.45 199.9,44.45 200.15,44.2 202.95,44.2 203.2,44.45 206.25,44.45 206.5,44.2 209.3,44.2 212.85,47.75 224.28,47.75 225.81,49.28 229.62,49.28 B06.D2
N_AC10  (via drill 0.61)
  Top 0.305: v125.48,16.26 125.98,16.76 125.98,19.05 127,20.07 v127,21.59 | v155.19,26.42 155.19,28.19 155.7,28.7 155.7,53.09 156.46,53.85 156.46,56.64 v156.72,56.9
  2 0.305: 231.9,56.39 231.9,51.05 233.43,49.53 233.43,46.74 B06.E2 | 231.9,56.39 231.9,110.49 233.43,112.01 233.43,115.32 A06.E2 | 231.9,56.39 v232.66,57.15
  15 0.305: v127,21.59 127.25,21.84 129.79,21.84 130.3,22.35 141.73,22.35 144.53,25.15 145.8,25.15 146.05,25.4 149.1,25.4 149.35,25.15 152.15,25.15 153.42,26.42 v155.19,26.42
  Bottom 0.305: v125.48,16.26 122.94,16.26 122.68,16 121.92,16 121.67,16.26 116.59,16.26 116.33,16 115.57,16 115.32,16.26 115.06,16.26 114.55,16.76 109.98,16.76 B16.R1 | v156.72,56.9 158.5,56.9 158.75,57.15 161.8,57.15 162.05,56.9 164.85,56.9 165.1,57.15 168.15,57.15 168.4,56.9 171.2,56.9 171.45,57.15 174.5,57.15 174.75,56.9 177.55,56.9 177.8,57.15 180.85,57.15 181.1,56.9 183.9,56.9 184.15,57.15 187.2,57.15 187.45,56.9 189.99,56.9 193.55,60.45 223.52,60.45 223.77,60.2 229.62,60.2 v232.66,57.15
N_AC11  (via drill 0.61)
  Top 0.305: v134.37,15.49 v134.37,13.72 | v155.7,22.35 v155.7,16 | v183.9,22.35 183.9,25.15 184.15,25.4 184.15,28.45 183.9,28.7 183.9,31.5 184.15,31.75 184.15,34.8 183.9,35.05 183.9,37.08 v184.91,38.1
  2 0.305: A06.H2 233.43,108.97 233.43,105.66 234.7,104.39 234.7,76.2 233.43,74.93 233.43,60.71 234.7,59.44 234.7,44.45 233.43,43.18 233.43,40.39 B06.H2
  15 0.305: v134.37,13.72 133.1,12.45 130.3,12.45 130.05,12.7 127,12.7 126.75,12.45 123.95,12.45 123.7,12.7 120.65,12.7 120.4,12.45 117.6,12.45 117.35,12.7 114.3,12.7 113.28,13.72 B16.S1
  Bottom 0.305: v134.37,15.49 136.14,15.49 136.65,16 v155.7,16 | v183.9,22.35 v155.7,22.35 | v184.91,38.1 187.2,38.1 187.45,37.85 190.25,37.85 190.5,38.1 193.55,38.1 193.8,37.85 196.6,37.85 196.85,38.1 199.9,38.1 200.15,37.85 202.95,37.85 203.2,38.1 206.25,38.1 206.5,37.85 209.3,37.85 209.55,38.1 212.6,38.1 212.85,37.85 215.65,37.85 215.9,38.1 218.95,38.1 219.2,37.85 222,37.85 222.25,38.1 225.3,38.1 225.55,37.85 228.35,37.85 230.12,39.62 232.66,39.62 B06.H2
N_ACCEPT  (via drill 0.61)
  Top 0.305: v206.5,25.4 206.5,22.61 205.99,22.1 205.99,19.05 208.03,17.02 208.03,14.99 B08.S2 | v203.2,84.58 203.2,82.55 202.95,82.3 202.95,79.25 203.2,78.99 203.2,75.95 202.69,75.44 202.69,73.66 203.96,72.39 203.96,57.66 202.69,56.39 202.69,55.37 200.15,52.83 200.15,28.7 199.64,28.19 v199.64,25.4
  Bottom 0.305: v206.5,25.4 203.2,25.4 202.95,25.15 200.15,25.15 199.9,25.4 v199.64,25.4 196.85,25.4 196.6,25.15 193.8,25.15 193.55,25.4 190.5,25.4 190.25,25.15 187.45,25.15 187.2,25.4 184.15,25.4 183.9,25.15 181.1,25.15 180.85,25.4 177.8,25.4 177.55,25.15 174.75,25.15 174.5,25.4 171.45,25.4 171.2,25.15 168.4,25.15 168.15,25.4 165.1,25.4 164.85,25.15 162.05,25.15 161.8,25.4 158.75,25.4 158.5,25.15 155.7,25.15 155.45,25.4 152.4,25.4 152.15,25.15 149.35,25.15 149.1,25.4 146.05,25.4 145.8,25.15 144.27,25.15 143,26.42 139.45,26.42 138.68,25.65 137.16,25.65 136.65,26.16 133.1,26.16 132.84,26.42 132.33,26.42 B14.M2 | v203.2,84.58 203.45,84.33 205.74,84.33 205.99,84.07 207.26,84.07 A08.S2
N_ACCLR  (via drill 0.61)
  Top 0.305: v101.85,68.33 101.85,57.4 101.35,56.9 101.35,54.1 101.6,53.85 101.6,50.8 101.35,50.55 101.35,50.29 98.04,46.99 98.04,43.69 97.54,43.18 B17.F1 | v142.24,64.52 v142.24,68.83 | v225.55,64.77 v225.55,88.65 | v237.74,20.57 237.74,21.84 238.25,22.35 238.25,56.9 237.74,57.4 v237.74,64.52
  Bottom 0.305: v101.85,68.33 102.11,68.07 113.28,68.07 113.79,68.58 123.44,68.58 123.7,68.83 v142.24,68.83 | v142.24,64.52 142.49,64.26 224.28,64.26 224.79,64.77 v225.55,64.77 225.81,64.52 v237.74,64.52 | v225.55,88.65 228.35,88.65 230.12,90.42 232.66,90.42 A06.P2 | v237.74,20.57 233.93,20.57 B06.P2
N_ADD00  (via drill 0.61)